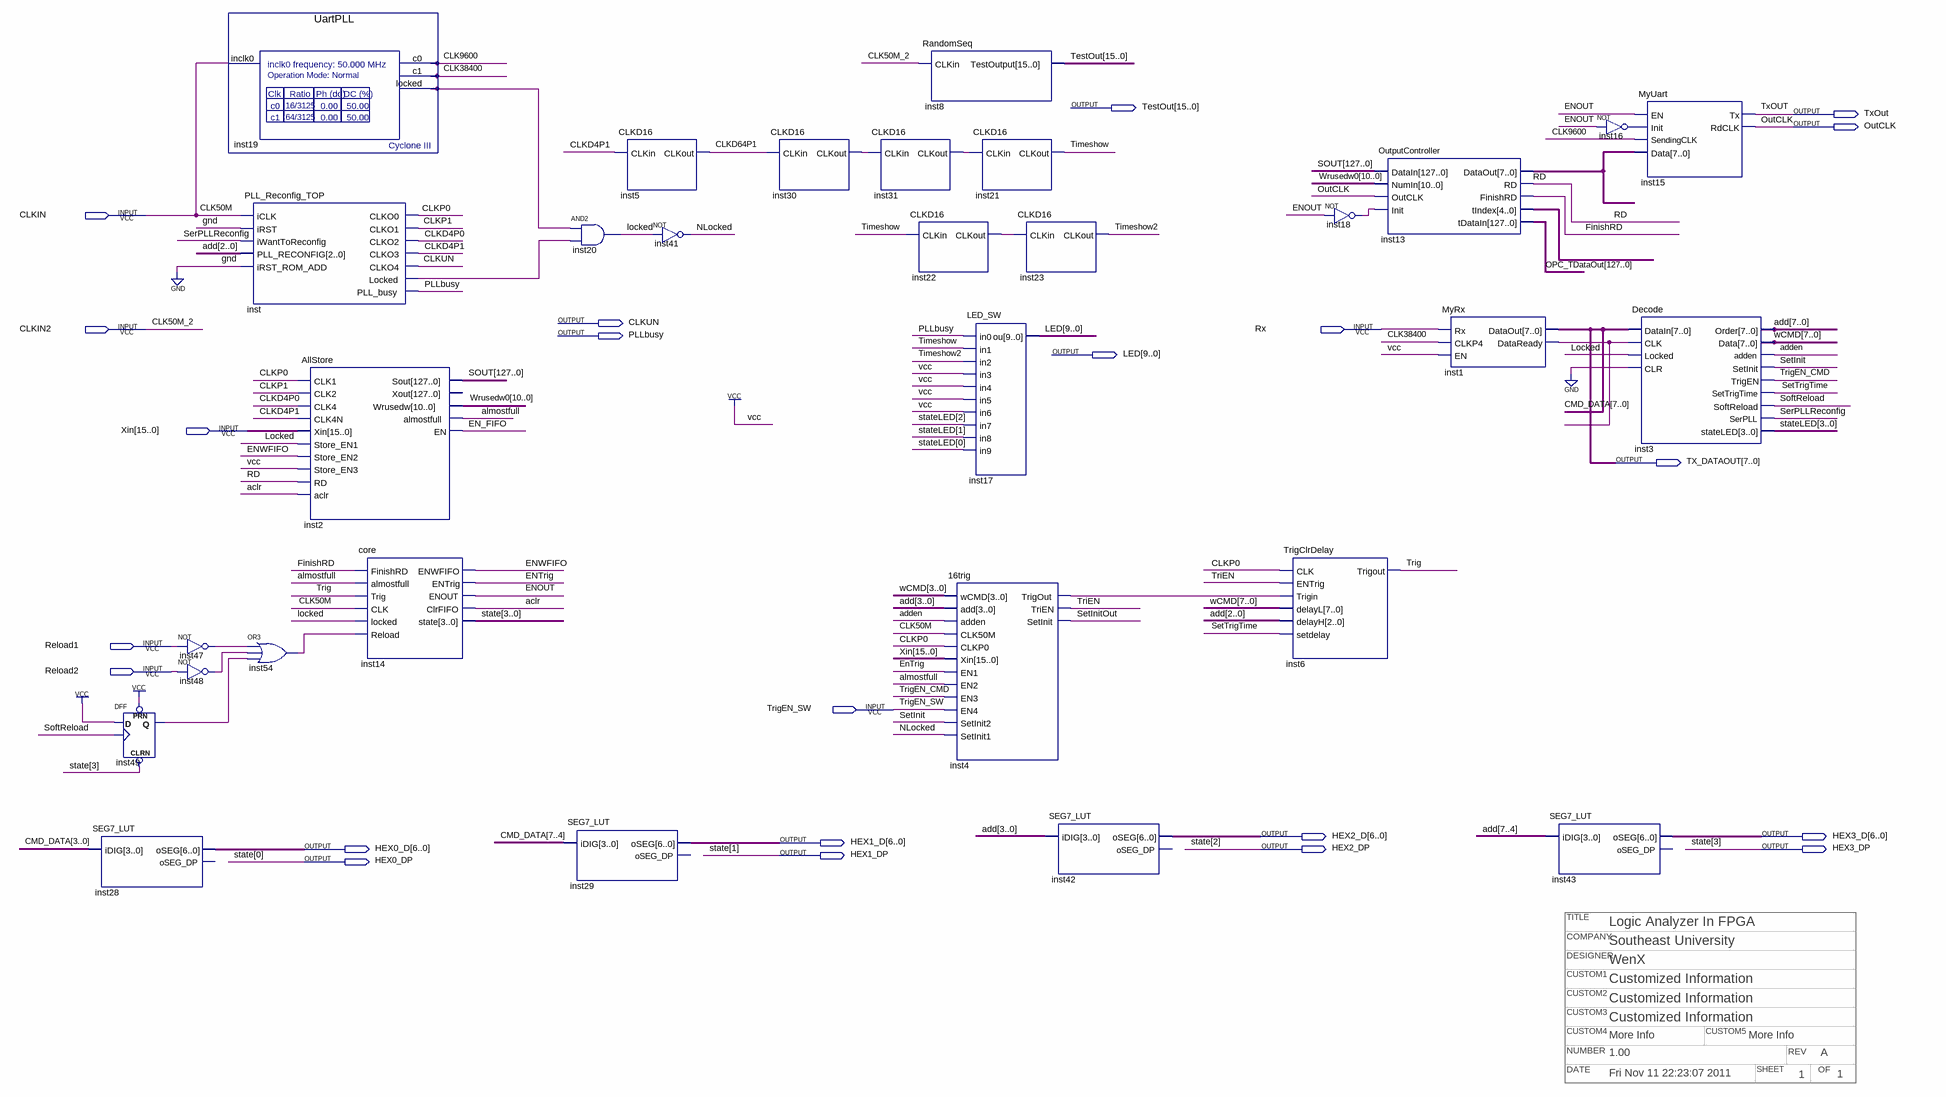
[diagram p0: schematic sheet]
// Quartus schematic Block1.bdf as structural Verilog: 30 symbols, 22 pins
// Title block: TITLE: Logic Analyzer In FPGA; COMPANY: Southeast University; DESIGNER: WenX; NUMBER: 1.00; REV: A; DATE: Fri Nov 11 22:23:07 2011; SHEET: 1; OF: 1; CUSTOM1: Customized Information; CUSTOM2: Customized Information; CUSTOM3: Customized Information; CUSTOM4: More Info; CUSTOM5: More Info
module Block1 (
  input  CLKIN,
  input  CLKIN2,
  input  Rx,
  input  [15:0] Xin,
  input  Reload1,
  input  Reload2,
  input  TrigEN_SW,
  output [15:0] TestOut,
  output TxOut,
  output OutCLK,
  output CLKUN,
  output PLLbusy,
  output [9:0] LED,
  output [7:0] TX_DATAOUT,
  output [6:0] HEX2_D,
  output [6:0] HEX3_D,
  output [6:0] HEX1_D,
  output [6:0] HEX0_D,
  output HEX2_DP,
  output HEX3_DP,
  output HEX1_DP,
  output HEX0_DP
);

  wire aclr, adden, almostfull, CLK9600, CLK38400, CLKD4P0, CLKD4P1, CLKD64P1, CLKP0, CLKP1, EN_FIFO, ENOUT,
       ENTrig, ENWFIFO, FinishRD, inst1_dataready, inst4_trigout, inst16_out, inst18_out, inst19_locked,
       inst22_clkout, inst30_clkout, inst31_clkout, inst47_out, inst48_out, inst49_q, inst54_out,
       inst_locked, locked, NLocked, RD, SerPLLReconfig, SetInit, SetInitOut, SetTrigTime, SoftReload,
       Timeshow, Timeshow2, TriEN, Trig, TrigEN_CMD;
  wire [3:0] stateLED;
  wire [4:0] inst13_tindex;
  wire [7:0] add, inst13_dataout, wCMD;
  wire [10:0] Wrusedw0;
  wire [127:0] OPC_TDataOut, SOUT;

  SEG7_LUT inst28 (.iDIG(TX_DATAOUT[3:0]), .oSEG(HEX0_D));  // open: oSEG_DP
  DFF inst49 (.CLRN(HEX3_DP), .CLK(SoftReload), .D(1'b1), .PRN(1'b1), .Q(inst49_q));
  not inst47 (inst47_out, Reload1);
  not inst48 (inst48_out, Reload2);
  UartPLL inst19 (.inclk0(CLKIN), .c0(CLK9600), .c1(CLK38400), .locked(inst19_locked));
  PLL_Reconfig_TOP inst (
    .iCLK(CLKIN), .iRST(1'b0), .iWantToReconfig(SerPLLReconfig), .PLL_RECONFIG(add[2:0]),
    .iRST_ROM_ADD(1'b0), .CLKO0(CLKP0), .CLKO1(CLKP1), .CLKO2(CLKD4P0), .CLKO3(CLKD4P1), .CLKO4(CLKUN),
    .Locked(inst_locked), .PLL_busy(PLLbusy));
  or inst54 (inst54_out, inst47_out, inst48_out, inst49_q);
  AllStore inst2 (
    .CLK1(CLKP0), .CLK2(CLKP1), .CLK4(CLKD4P0), .CLK4N(CLKD4P1), .Xin(Xin), .Store_EN1(locked),
    .Store_EN2(ENWFIFO), .Store_EN3(1'b1), .RD(RD), .aclr(aclr), .Sout(SOUT), .Wrusedw(Wrusedw0),
    .almostfull(almostfull), .EN(EN_FIFO));  // open: Xout
  core inst14 (
    .FinishRD(FinishRD), .almostfull(almostfull), .Trig(Trig), .CLK(CLKIN), .locked(locked),
    .Reload(inst54_out), .ENWFIFO(ENWFIFO), .ENTrig(ENTrig), .ENOUT(ENOUT), .ClrFIFO(aclr),
    .state({HEX3_DP, HEX2_DP, HEX1_DP, HEX0_DP}));
  and inst20 (locked, inst19_locked, inst_locked);
  SEG7_LUT inst29 (.iDIG(TX_DATAOUT[7:4]), .oSEG(HEX1_D));  // open: oSEG_DP
  CLKD16 inst5 (.CLKin(CLKD4P1), .CLKout(CLKD64P1));
  not inst41 (NLocked, locked);
  CLKD16 inst30 (.CLKin(CLKD64P1), .CLKout(inst30_clkout));
  CLKD16 inst31 (.CLKin(inst30_clkout), .CLKout(inst31_clkout));
  CLKD16 inst22 (.CLKin(Timeshow), .CLKout(inst22_clkout));
  RandomSeq inst8 (.CLKin(CLKIN2), .TestOutput(TestOut));
  LED_SW inst17 (
    .in0(PLLbusy), .in1(Timeshow), .in2(Timeshow2), .in3(1'b1), .in4(1'b1), .in5(1'b1), .in6(1'b1),
    .in7(stateLED[2]), .in8(stateLED[1]), .in9(stateLED[0]), .ou(LED));
  \16trig  inst4 (
    .wCMD(wCMD[3:0]), .add(add[3:0]), .adden(adden), .CLK50M(CLKIN), .CLKP0(CLKP0), .Xin(Xin), .EN1(ENTrig),
    .EN2(almostfull), .EN3(TrigEN_CMD), .EN4(TrigEN_SW), .SetInit2(SetInit), .SetInit1(NLocked),
    .TrigOut(inst4_trigout), .TriEN(TriEN), .SetInit(SetInitOut));
  CLKD16 inst21 (.CLKin(inst31_clkout), .CLKout(Timeshow));
  CLKD16 inst23 (.CLKin(inst22_clkout), .CLKout(Timeshow2));
  SEG7_LUT inst42 (.iDIG(add[3:0]), .oSEG(HEX2_D));  // open: oSEG_DP
  TrigClrDelay inst6 (
    .CLK(CLKP0), .ENTrig(TriEN), .Trigin(inst4_trigout), .delayL(wCMD), .delayH(add[2:0]),
    .setdelay(SetTrigTime), .Trigout(Trig));
  not inst18 (inst18_out, ENOUT);
  OutputController inst13 (
    .DataIn(SOUT), .NumIn(Wrusedw0), .OutCLK(OutCLK), .Init(inst18_out), .DataOut(inst13_dataout), .RD(RD),
    .FinishRD(FinishRD), .tIndex(inst13_tindex), .tDataIn(OPC_TDataOut));
  MyRx inst1 (.Rx(Rx), .CLKP4(CLK38400), .EN(1'b1), .DataOut(TX_DATAOUT), .DataReady(inst1_dataready));
  SEG7_LUT inst43 (.iDIG(add[7:4]), .oSEG(HEX3_D));  // open: oSEG_DP
  not inst16 (inst16_out, ENOUT);
  MyUart inst15 (
    .EN(ENOUT), .Init(inst16_out), .SendingCLK(CLK9600), .Data(inst13_dataout), .Tx(TxOut), .RdCLK(OutCLK));
  Decode inst3 (
    .DataIn(TX_DATAOUT), .CLK(inst1_dataready), .Locked(locked), .CLR(1'b0), .Order(add), .Data(wCMD),
    .adden(adden), .SetInit(SetInit), .TrigEN(TrigEN_CMD), .SetTrigTime(SetTrigTime),
    .SoftReload(SoftReload), .SerPLL(SerPLLReconfig), .stateLED(stateLED));

  // Other names for the same wires on the sheet: CLK50M_2 = CLKIN2; CLK50M = CLKIN; CMD_DATA[7:0] = TX_DATAOUT;
  //   state[3:0] = {HEX3_DP, HEX2_DP, HEX1_DP, HEX0_DP}
endmodule
